# Altium schematic sheet Sheet1.SchDoc
size A4; SheetNumber: 1; SheetTotal: 1; SPICEModelCacheZUJSEUHX: <root> / <DocumentId>ZUJSEUHX</DocumentId> / <CacheFrame Number="0"> / <Model Name="cap" Kind="MDL"> / <Text>*Default semiconductor capacitor / .MODEL CAP C()</Text> / </Model> / <Model Name="led0" Kind="MDL"> / <Text>*Typ INFRARED GaAs LED: Vf=1.2V Vr=5V If=40mA trr=3uS / *LED Pinout: 1=A, 2=K / .MODEL LED0 D (IS=93.5P RS=84M N=2.63 BV=5 IBV=10U / + CJO=2.97P VJ=.75 M=.333 TT=4.32U)</Text> / </Model> / </CacheFrame> / </root>
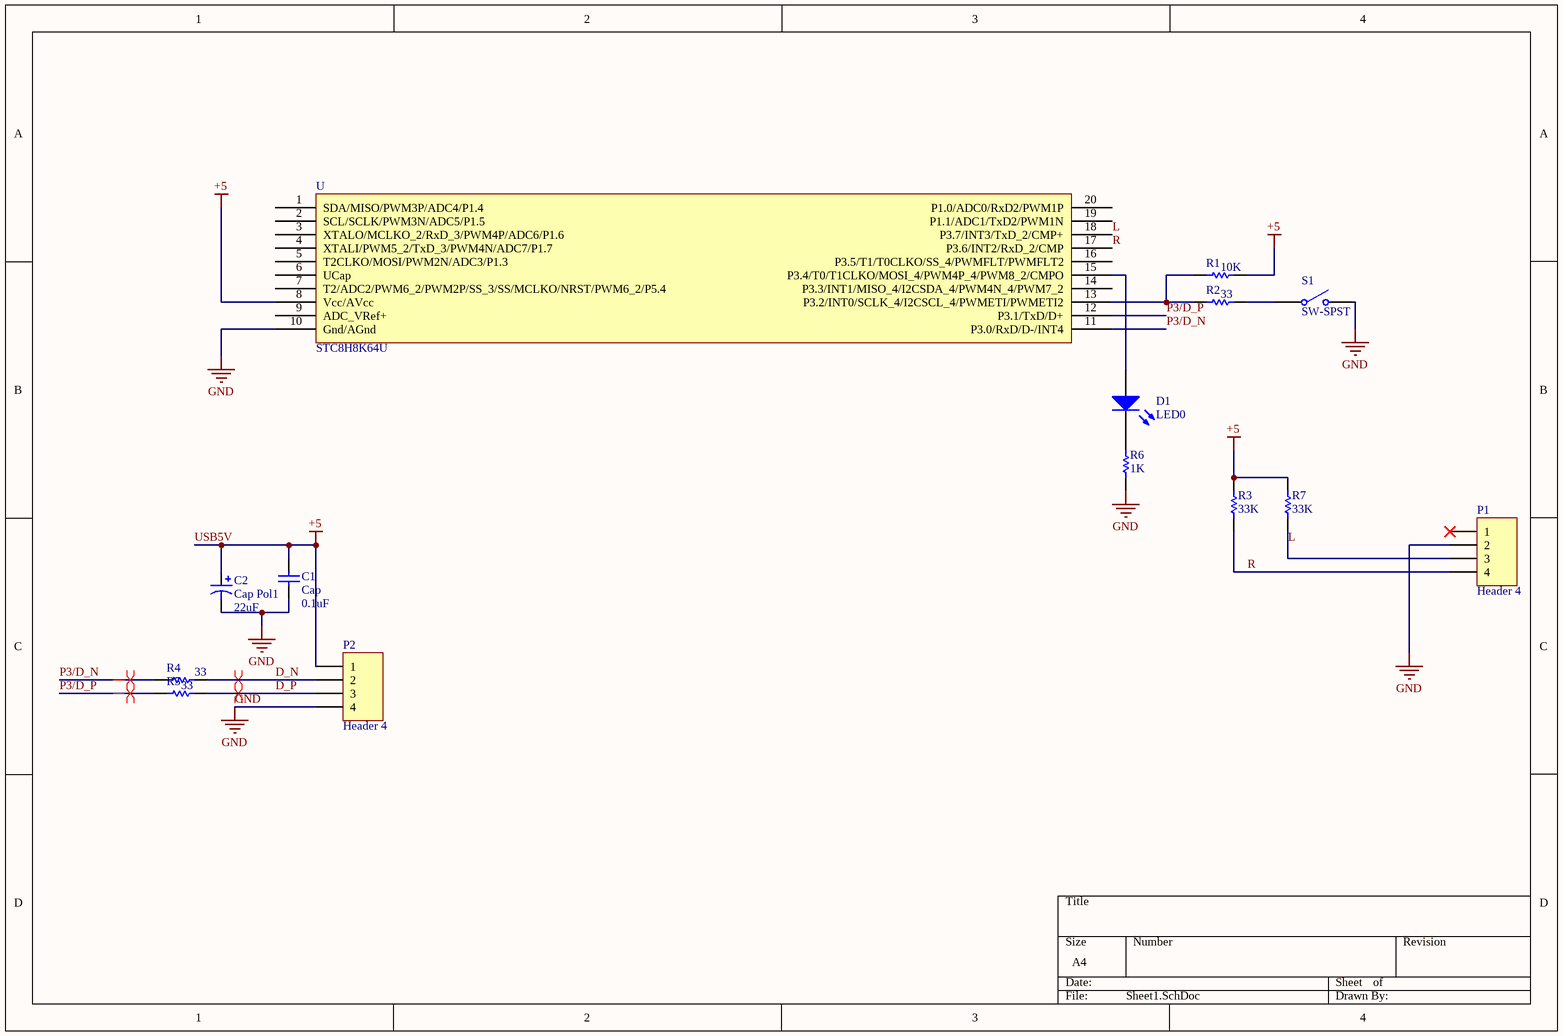
[diagram p0: Sheet1.SchDoc]

## Parts
C1  Cap  value 0.1uF  [1608(0603)_C]
C2  Cap Pol1  value 22uF  [1608(0603)_C]
D1  LED0  [1608(0603)_R]
P1  Header 4  [PJ-313D]
P2  Header 4  [USB-A-DIP]
R1  value 10K  [1608(0603)_R]  (hidden comment: Res1)
R2  value 33  [1608(0603)_R]  (hidden comment: Res1)
R3  value 33K  [1608(0603)_R]  (hidden comment: Res1)
R4  value 33  [1608(0603)_R]  (hidden comment: Res1)
R5  value 33  [1608(0603)_R]  (hidden comment: Res1)
R6  value 1K  [1608(0603)_R]  (hidden comment: Res1)
R7  value 33K  [1608(0603)_R]  (hidden comment: Res1)
S1  SW-SPST  [SWITCH2 3*6*2.5]
U  STC8H8K64U  [TSOP65P640X120-20N]

## Nets
GND: C1.1 C2.2 P1.2 P2.4 R6.2 S1.2(NO) U.10(Gnd/AGnd)
USB5V: C1.2 C2.1 P2.1 R1.1 R3.1 R7.1 U.8(Vcc/AVcc)  [also labelled +5]
D_N: P2.2 R4.1
D_P: P2.3 R5.1
L: P1.3 R7.2 U.18(P3.7/INT3/TxD_2/CMP+)
P3/D_N: R4.2 U.11(P3.0/RxD/D-/INT4)
P3/D_P: R5.2 U.12(P3.1/TxD/D+)
R: P1.4 R3.2 U.17(P3.6/INT2/RxD_2/CMP)
NetD1_1: D1.1(A) U.15(P3.4/T0/T1CLKO/MOSI_4/PWM4P_4/PWM8_2/CMPO)
NetD1_2: D1.2(K) R6.1
NetR1_2: R1.2 R2.2 U.13(P3.2/INT0/SCLK_4/I2CSCL_4/PWMETI/PWMETI2)
NetR2_1: R2.1 S1.1(COMMON)

Not connected (* = marked no-connect by the designer): P1 1*; U 1(SDA/MISO/PWM3P/ADC4/P1.4) 2(SCL/SCLK/PWM3N/ADC5/P1.5) 3(XTALO/MCLKO_2/RxD_3/PWM4P/ADC6/P1.6) 4(XTALI/PWM5_2/TxD_3/PWM4N/ADC7/P1.7) 5(T2CLKO/MOSI/PWM2N/ADC3/P1.3) 6(UCap) 7(T2/ADC2/PWM6_2/PWM2P/SS_3/SS/MCLKO/NRST/PWM6_2/P5.4) 9(ADC_VRef+) 14(P3.3/INT1/MISO_4/I2CSDA_4/PWM4N_4/PWM7_2) 16(P3.5/T1/T0CLKO/SS_4/PWMFLT/PWMFLT2) 19(P1.1/ADC1/TxD2/PWM1N) 20(P1.0/ADC0/RxD2/PWM1P)

## Layout directives
differential pair: D_N, D_P, P3/D_N, P3/D_P

## Library data of the parts
C1 = Cap: Capacitor; Published: 8-Jun-2000; LatestRevisionDate: 17-Jul-2002; LatestRevisionNote: Re-released for DXP Platform.; PackageReference: RAD-0.3; Publisher: Altium Limited; PackageDescription: Radial Cap, Thru-Hole; 2 Leads; 0.3 in Pin Spacing
C2 = Cap Pol1: Polarized Capacitor (Radial); Published: 8-Jun-2000; LatestRevisionDate: 17-Jul-2002; LatestRevisionNote: Re-released for DXP Platform.; PackageReference: RB7.6-15; Publisher: Altium Limited; PackageDescription: Polarized Capacitor (Radial); 2 Leads
D1 = LED0: Typical INFRARED GaAs LED; Published: 8-Jun-2000; LatestRevisionDate: 08-Jul-2005; LatestRevisionNote: Mech Layer 1 removed.; PackageReference: LED-0; Publisher: Altium Limited; PackageDescription: LED; 2 Leads
P1 = Header 4: Header, 4-Pin; LatestRevisionDate: 17-Jul-2002; LatestRevisionNote: Re-released for DXP Platform.; Publisher: Altium Limited
P2 = Header 4: Header, 4-Pin; pin to pad: 1>4 2>3 3>2 4>1; LatestRevisionDate: 17-Jul-2002; LatestRevisionNote: Re-released for DXP Platform.; Publisher: Altium Limited
R1-R7 = Res1: Resistor; Published: 8-Jun-2000; LatestRevisionDate: 17-Jul-2002; LatestRevisionNote: Re-released for DXP Platform.; PackageReference: AXIAL-0.3; Publisher: Altium Limited; PackageDescription: Axial Device, Thru-Hole; 2 Leads; 0.3 in Pin Spacing
S1 = SW-SPST: Single-Pole, Single-Throw Switch; Published: 24-Mar-1999; LatestRevisionDate: 17-Jul-2002; LatestRevisionNote: Re-released for DXP Platform.; PackageReference: SPST-2; Publisher: Altium Limited; PackageDescription: Switch; 2 Leads